# Altium schematic sheet Amplifier.SchDoc
size A4; SheetNumber: 2; SheetTotal: 2
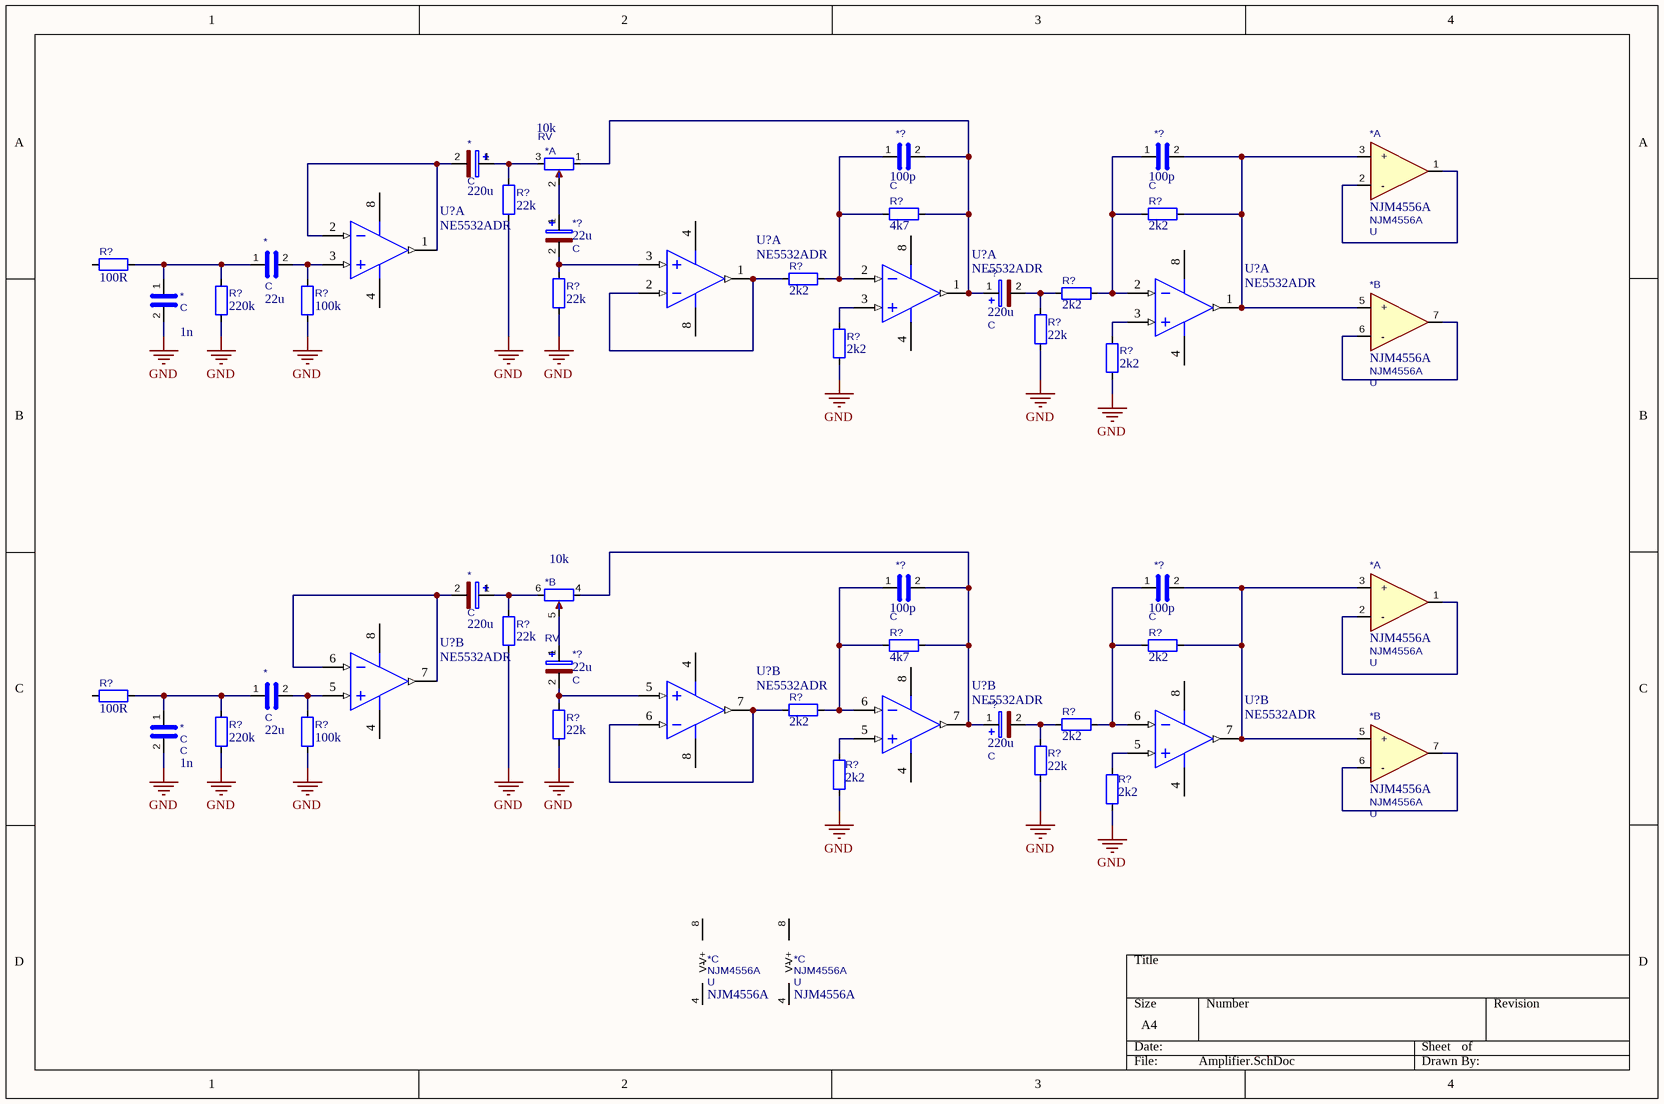
[diagram p0: Amplifier.SchDoc]

## Parts
(Parts that share a designator on the sheet are numbered #1, #2 ... from top to bottom, then left to right.)
*#1  220u  220u: C
*#2  10k  10k: RV  (part A of 2)
*#3  NJM4556A  Reference: U  (part A of 3)
*#4  22u
*#5  1n
*#6  NJM4556A  Reference: U  (part B of 3)
*#7  220u  220u: C
*#8  10k  10k: RV  (part B of 2)
*#9  NJM4556A  Reference: U  (part A of 3)
*#10  22u
*#11  1n  value C
*#12  NJM4556A  Reference: U  (part B of 3)
*#13  NJM4556A  Reference: U  (part C of 3)
*#14  NJM4556A  Reference: U  (part C of 3)
*?#1  100p
*?#2  100p
*?#3  22u  220u: C
*?#4  220u  220u: C
*?#5  100p
*?#6  100p
*?#7  22u  220u: C
*?#8  220u  220u: C
R?#1  22k
R?#2  4k7
R?#3  2k2
R?#4  100R
R?#5  2k2
R?#6  22k
R?#7  2k2
R?#8  220k
R?#9  100k
R?#10  22k
R?#11  2k2
R?#12  2k2
R?#13  22k
R?#14  4k7
R?#15  2k2
R?#16  100R
R?#17  2k2
R?#18  22k
R?#19  2k2
R?#20  220k
R?#21  100k
R?#22  22k
R?#23  2k2
R?#24  2k2
U?#1  NE5532ADR  [D0008A_M]  (part A of 2)
U?#2  NE5532ADR  [D0008A_M]  (part A of 2)
U?#3  NE5532ADR  [D0008A_M]  (part A of 2)
U?#4  NE5532ADR  [D0008A_M]  (part A of 2)
U?#5  NE5532ADR  [D0008A_M]  (part B of 2)
U?#6  NE5532ADR  [D0008A_M]  (part B of 2)
U?#7  NE5532ADR  [D0008A_M]  (part B of 2)
U?#8  NE5532ADR  [D0008A_M]  (part B of 2)

## Nets
GND: *#5.2 *#11.2 R?#1.2 R?#6.2 R?#8.2 R?#9.2 R?#10.2 R?#11.2 R?#12.2 R?#13.2 R?#18.2 R?#20.2 R?#21.2 R?#22.2 R?#23.2 R?#24.2
Net*#1_1: *#1.1 *#2.3 R?#1.1
Net*#1_2: *#1.2 U?#1.1(OUT1) U?#1.2(IN1-)
Net*#2_1: *#2.1 *?#1.2 *?#4.1 R?#2.1 U?#2.1(OUT1)
Net*#2_2: *#2.2 *?#3.1
Net*#3_1: *#3.1 *#3.2(-)
Net*#3_3: *#3.3(+) *#6.5(+) *?#2.2 R?#3.1 U?#3.1(OUT1)
Net*#4_1: *#4.1 *#5.1 R?#4.2 R?#8.1
Net*#4_2: *#4.2 R?#9.1 U?#1.3(IN1+)
Net*#6_6: *#6.6(-) *#6.7
Net*#7_1: *#7.1 *#8.6 R?#13.1
Net*#7_2: *#7.2 U?#5.6(IN2-) U?#5.7(OUT2)
Net*#8_4: *#8.4 *?#5.2 *?#8.1 R?#14.1 U?#6.7(OUT2)
Net*#8_5: *#8.5 *?#7.1
Net*#9_1: *#9.1 *#9.2(-)
Net*#9_3: *#9.3(+) *#12.5(+) *?#6.2 R?#15.1 U?#7.7(OUT2)
Net*#10_1: *#10.1 *#11.1 R?#16.2 R?#20.1
Net*#10_2: *#10.2 R?#21.1 U?#5.5(IN2+)
Net*#12_6: *#12.6(-) *#12.7
Net*?#1_1: *?#1.1 R?#2.2 R?#5.1 U?#2.2(IN1-)
Net*?#2_1: *?#2.1 R?#3.2 R?#7.1 U?#3.2(IN1-)
Net*?#3_2: *?#3.2 R?#6.1 U?#4.3(IN1+)
Net*?#4_2: *?#4.2 R?#7.2 R?#10.1
Net*?#5_1: *?#5.1 R?#14.2 R?#17.1 U?#6.6(IN2-)
Net*?#6_1: *?#6.1 R?#15.2 R?#19.1 U?#7.6(IN2-)
Net*?#7_2: *?#7.2 R?#18.1 U?#8.5(IN2+)
Net*?#8_2: *?#8.2 R?#19.2 R?#22.1
NetR?#5_2: R?#5.2 U?#4.1(OUT1) U?#4.2(IN1-)
NetR?#11_1: R?#11.1 U?#2.3(IN1+)
NetR?#12_1: R?#12.1 U?#3.3(IN1+)
NetR?#17_2: R?#17.2 U?#8.6(IN2-) U?#8.7(OUT2)
NetR?#23_1: R?#23.1 U?#6.5(IN2+)
NetR?#24_1: R?#24.1 U?#7.5(IN2+)

Not connected (* = marked no-connect by the designer): *#13 4(V-) 8(V+); *#14 4(V-) 8(V+); R?#4 1; R?#16 1; U?#1 4(VCC-) 8(VCC+); U?#2 4(VCC-) 8(VCC+); U?#3 4(VCC-) 8(VCC+); U?#4 4(VCC-) 8(VCC+); U?#5 4(VCC-) 8(VCC+); U?#6 4(VCC-) 8(VCC+); U?#7 4(VCC-) 8(VCC+); U?#8 4(VCC-) 8(VCC+)

## Library data of the parts
*#1 *#7 *?#3 *?#4 *?#7 *?#8 = C_Polarized: Polarized capacitor; ki_keywords: cap capacitor; ki_fp_filters: CP_*; Reference: C; Datasheet: ~; Description_: Polarized capacitor
*#2 *#8 = R_Potentiometer_Dual_Separate: Dual potentiometer, separate units; ki_keywords: resistor variable; ki_fp_filters: Potentiometer*; Reference: RV; Datasheet: ~; Description_: Dual potentiometer, separate units
*#3 *#6 *#9 *#12-*#14 = NJM4556A: Dual High Current Operational Amplifier, DIP-8/DMP-8/SIP-8/SSOP-8; ki_keywords: dual opamp; ki_fp_filters: SOIC*3.9x4.9mm*P1.27mm* DIP*W7.62mm* TO*99* OnSemi*Micro8* TSSOP*3x3mm*P0.65mm* TSSOP*4.4x3mm*P0.65mm* MSOP*3x3mm*P0.65mm* SSOP*3.9x4.9mm*P0.635mm* LFCSP*2x2mm*P0.5mm* *SIP* SOIC*5.3x6.2mm*P1.27mm*; Value: NJM4556A; Datasheet: http://www.njr.com/semicon/PDF/NJM4556A_E.pdf; Description_: Dual High Current Operational Amplifier, DIP-8/DMP-8/SIP-8/SSOP-8
*#4 *#5 *#10 *#11 *?#1 *?#2 *?#5 *?#6 = C: Unpolarized capacitor; ki_keywords: cap capacitor; ki_fp_filters: C_*; Reference: C; Datasheet: ~; Description_: Unpolarized capacitor
  *#4 *#10: 22u: C
  *#5: 1n: C
  *?#1 *?#2 *?#5 *?#6: 100p: C
R?#1-R?#24 = R: Resistor
U?#1-U?#8 = CMP-0017-00450-2: Dual Low-Noise Operational Amplifier, 10 to 30 V, 0 to 70 degC, 8-pin SOIC (D8), Green (RoHS & no Sb/Br); Manufacturer: Texas Instruments; Total Supply Voltage(Min)(+5V is 5, +/-5V is 10): 10; Slew Rate(Typ)(V/us): 9; Sub Family: General Purpose Amplifier, High Supply Voltage Amplifier (>=30V), Low Noise Amp (<=10nV/rtHz); Vio (25C)(Max)(mV): 4; IIB(Max)(pA): 800000; Vn at 1kHz(Typ)(nV/rtHz): 5; Number of Channels: 2; Total Supply Voltage(Max)(+5V is 5, +/-5V is 10): 30; CMRR(Min)(dB): 70; Code_JEDEC: MS-012; ComponentLink1URL: http://www.ti.com/; DatasheetVersion: SLOS075I; PackageDescription: 8-Pin Plastic Small Outline, Body 4.9 x 3.9 mm, Pitch 1.27 mm; Eco-Plan: Green (RoHS & no Sb/Br); ComponentLink3Description: Package Specification; PackageReference: D0008A; Mounting Technology: Surface Mount; GBW(Typ)(MHz): 10; ComponentLink2Description: Datasheet; ComponentLink1Description: Manufacturer URL; PartNumber: NE5532ADR; ComponentLink3URL: http://www.ti.com/litv/pdf/msoi002j; PackageVersion: 4040047-3/M, 06/2011; ComponentLink2URL: http://www.ti.com/lit/ds/symlink/ne5532a.pdf; Iq per channel(Max)(mA): 4